# EAGLE design acb (EAGLE 7.5.0)
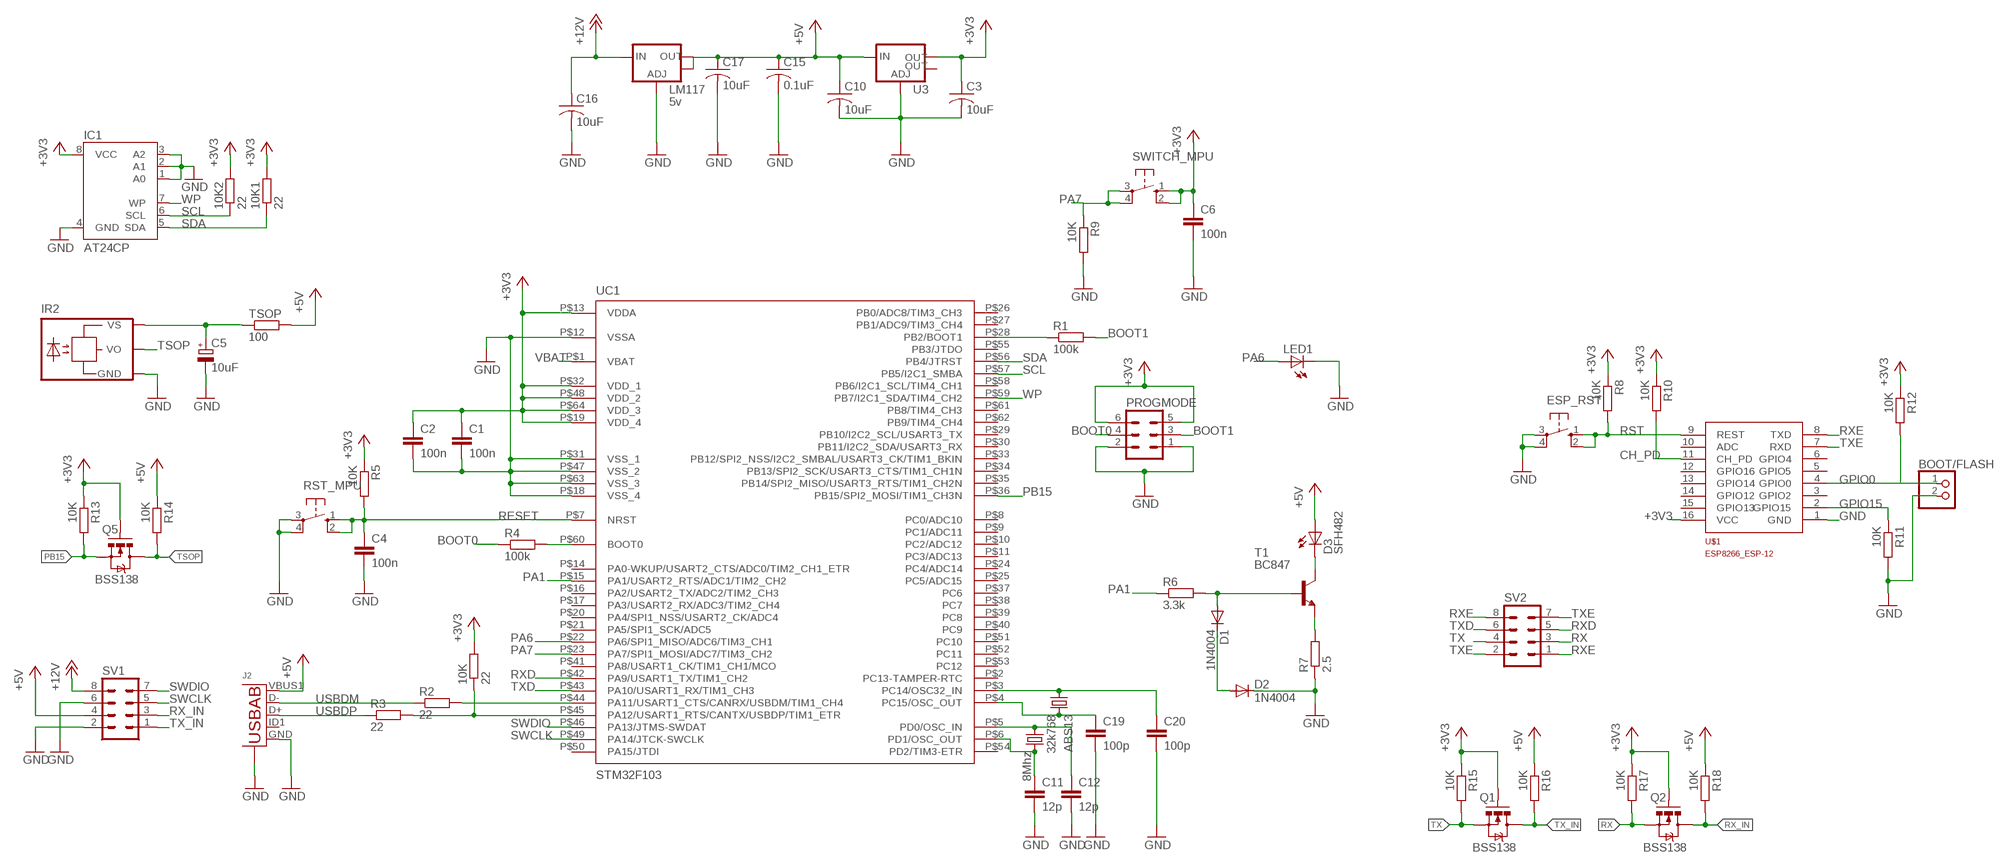
[diagram p0: schematic, sheet 1]

## Parts
10K  22  R-EU_R1206  [R1206]
10K1  22  R-EU_R1206  [R1206]
10K2  22  R-EU_R1206  [R1206]
ABS13  32k768  XTAL_9HT4  [9HT7]
BOOT/FLASH  PINHD-1X2  [1X02]
C1  100n  C-EUC1206  [C1206]
C2  100n  C-EUC1206  [C1206]
C3  10uF  C-USC1206  [C1206]
C4  100n  C-EUC1206  [C1206]
C5  10uF  CPOL-EUE2.5-6  [E2,5-6]
C6  100n  C-EUC1206  [C1206]
C10  10uF  C-USC1206  [C1206]
C11  12p  C-EUC1206  [C1206]
C12  12p  C-EUC1206  [C1206]
C15  0.1uF  C-USC0805  [C0805]
C16  10uF  C-USC0805  [C0805]
C17  10uF  C-USC0805  [C0805]
C19  100p  C-EUC1206  [C1206]
C20  100p  C-EUC1206  [C1206]
D1  1N4004  [DO41-10]
D2  1N4004  [DO41-10]
D3  SFH482  [SFH482]
ESP_RST  10-XX  [B3F-10XX]
IC1  AT24CP  [DIL08]
IR2  TSOP1730TB1  [TSOP17_TB1]
J2  USB-ABBG  [USB-AB-MICRO-SMD_V03_SF]
LED1  LED5MM  [LED5MM]
LM117  5v  V_REG_LM1117SOT223  [SOT223]
PROGMODE  MA03-2  [MA03-2]
Q1  BSS138  MOSFET-NCHANNELSMD  [SOT23-3]
Q2  BSS138  MOSFET-NCHANNELSMD  [SOT23-3]
Q3  8Mhz  CRYSTALHC49U-V  [HC49U-V]
Q5  BSS138  MOSFET-NCHANNELSMD  [SOT23-3]
R1  100k  R-EU_R1206  [R1206]
R2  22  R-EU_R1206  [R1206]
R3  22  R-EU_R1206  [R1206]
R4  100k  R-EU_R1206  [R1206]
R5  10K  R-EU_R1206  [R1206]
R6  3.3k  R-EU_R1206  [R1206]
R7  2.5  R-EU_R1206  [R1206]
R8  10K  R-EU_R1206  [R1206]
R9  10K  R-EU_R1206  [R1206]
R10  10K  R-EU_R1206  [R1206]
R11  10K  R-EU_R1206  [R1206]
R12  10K  R-EU_R1206  [R1206]
R13  10K  R-EU_R1206  [R1206]
R14  10K  R-EU_R1206  [R1206]
R15  10K  R-EU_R1206  [R1206]
R16  10K  R-EU_R1206  [R1206]
R17  10K  R-EU_R1206  [R1206]
R18  10K  R-EU_R1206  [R1206]
RST_MPU  10-XX  [B3F-10XX]
SV1  MA04-2  [MA04-2]
SV2  MA04-2  [MA04-2]
SWITCH_MPU  10-XX  [B3F-10XX]
T1  BC847  [SOT23]
TSOP  100  R-EU_R1206  [R1206]
U3  V_REG_LM1117SOT223  [SOT223]
U$1  ESP8266_ESP-12  [ESP8266-ESP12]
UC1  STM32F103  [TQFP-10X10-64]

## Nets
+3V3: 10K1.2 10K2.2 10K.2 C1.1 C2.1 C3.1 C6.1 IC1.8(VCC) PROGMODE.5 PROGMODE.6 Q1.1(G) Q2.1(G) Q5.1(G) R5.1 R8.1 R10.1 R12.1 R13.1 R15.1 R17.1 SWITCH_MPU.1(S) SWITCH_MPU.2(S1) U3.2(OUT) U$1.16(VCC) UC1.P$13(VDDA) UC1.P$19(VDD_4) UC1.P$32(VDD_1) UC1.P$48(VDD_2) UC1.P$64(VDD_3)
+5V: C10.1 C15.1 C17.1 D3.A J2.VBUS1(VBUS) LM117.2(OUT) LM117.4(OUT) R14.1 R16.1 R18.1 SV1.4 TSOP.2 U3.3(IN)
+12V: C16.1 LM117.3(IN) SV1.8
BOOT0: PROGMODE.4 R4.1
BOOT1: PROGMODE.3 R1.2
CH_PD: R10.2 U$1.11(CH_PD)
GND: BOOT/FLASH.2 C1.2 C2.2 C3.2 C4.2 C5.- C6.2 C10.2 C11.2 C12.2 C15.2 C16.2 C17.2 C19.2 C20.2 D2.C ESP_RST.3(P) ESP_RST.4(P1) IC1.1(A0) IC1.2(A1) IC1.3(A2) IC1.4(GND) IR2.GND J2.GND J2.S1(S) J2.S2(S) J2.S3(S) J2.S4(S) LED1.K(C) LM117.1(ADJ) PROGMODE.1 PROGMODE.2 R7.1 R9.2 R11.2 RST_MPU.3(P) RST_MPU.4(P1) SV1.2 SV1.6 U3.1(ADJ) U$1.1(GND) UC1.P$12(VSSA) UC1.P$18(VSS_4) UC1.P$31(VSS_1) UC1.P$47(VSS_2) UC1.P$63(VSS_3)
GPIO0: BOOT/FLASH.1 R12.2 U$1.4(GPIO0)
GPIO15: R11.1 U$1.2(GPIO15)
N$1: R1.1 UC1.P$28(PB2/BOOT1)
N$2: R2.2 UC1.P$44(PA11/USART1_CTS/CANRX/USBDM/TIM1_CH4)
N$3: 10K.1 R3.2 UC1.P$45(PA12/USART1_RTS/CANTX/USBDP/TIM1_ETR)
N$4: R4.2 UC1.P$60(BOOT0)
N$5: C12.1 Q3.1 UC1.P$5(PD0/OSC_IN)
N$6: C11.1 Q3.2 UC1.P$6(PD1/OSC_OUT)
N$7: ABS13.4 C19.1 UC1.P$4(PC15/OSC_OUT)
N$8: ABS13.1 C20.1 UC1.P$3(PC14/OSC32_IN)
N$9: C5.+ IR2.VS TSOP.1
N$10: D1.A R6.2 T1.1(B)
N$11: D1.C D2.A
N$12: R7.2 T1.2(E)
N$13: D3.K(C) T1.3(C)
PA1: R6.1 UC1.P$15(PA1/USART2_RTS/ADC1/TIM2_CH2)
PA6: LED1.A UC1.P$22(PA6/SPI1_MISO/ADC6/TIM3_CH1)
PA7: R9.1 SWITCH_MPU.3(P) SWITCH_MPU.4(P1) UC1.P$23(PA7/SPI1_MOSI/ADC7/TIM3_CH2)
PB15: Q5.2(S) R13.2 UC1.P$36(PB15/SPI2_MOSI/TIM1_CH3N)
RESET: C4.1 R5.2 RST_MPU.1(S) RST_MPU.2(S1) UC1.P$7(NRST)
RST: ESP_RST.1(S) ESP_RST.2(S1) R8.2 U$1.9(REST)
RX: Q2.2(S) R17.2 SV2.3
RX_IN: Q2.3(D) R18.2 SV1.3
RXD: SV2.5 UC1.P$42(PA9/USART1_TX/TIM1_CH2)
RXE: SV2.1 SV2.8 U$1.8(TXD)
SCL: 10K2.1 IC1.6(SCL) UC1.P$57(PB5/I2C1_SMBA)
SDA: 10K1.1 IC1.5(SDA) UC1.P$56(PB4/JTRST)
SWCLK: SV1.5 UC1.P$49(PA14/JTCK-SWCLK)
SWDIO: SV1.7 UC1.P$46(PA13/JTMS-SWDAT)
TSOP: IR2.VO Q5.3(D) R14.2
TX: Q1.2(S) R15.2 SV2.4
TX_IN: Q1.3(D) R16.2 SV1.1
TXD: SV2.6 UC1.P$43(PA10/USART1_RX/TIM1_CH3)
TXE: SV2.2 SV2.7 U$1.7(RXD)
USBDM: J2.D- R2.1
USBDP: J2.D+ R3.1
VBAT: UC1.P$1(VBAT)
WP: IC1.7(WP) UC1.P$59(PB7/I2C1_SDA/TIM4_CH2)
Unconnected: J2.ID1(USBID) U3.4(OUT) U$1.3(GPIO2) U$1.5(GPIO5) U$1.6(GPIO4) U$1.10(ADC) U$1.12(GPIO16) U$1.13(GPIO14) U$1.14(GPIO12) U$1.15(GPIO13) UC1.P$2(PC13-TAMPER-RTC) UC1.P$8(PC0/ADC10) UC1.P$9(PC1/ADC11) UC1.P$10(PC2/ADC12) UC1.P$11(PC3/ADC13) UC1.P$14(PA0-WKUP/USART2_CTS/ADC0/TIM2_CH1_ETR) UC1.P$16(PA2/USART2_TX/ADC2/TIM2_CH3) UC1.P$17(PA3/USART2_RX/ADC3/TIM2_CH4) UC1.P$20(PA4/SPI1_NSS/USART2_CK/ADC4) UC1.P$21(PA5/SPI1_SCK/ADC5) UC1.P$24(PC4/ADC14) UC1.P$25(PC5/ADC15) UC1.P$26(PB0/ADC8/TIM3_CH3) UC1.P$27(PB1/ADC9/TIM3_CH4) UC1.P$29(PB10/I2C2_SCL/USART3_TX) UC1.P$30(PB11/I2C2_SDA/USART3_RX) UC1.P$33(PB12/SPI2_NSS/I2C2_SMBAL/USART3_CK/TIM1_BKIN) UC1.P$34(PB13/SPI2_SCK/USART3_CTS/TIM1_CH1N) UC1.P$35(PB14/SPI2_MISO/USART3_RTS/TIM1_CH2N) UC1.P$37(PC6) UC1.P$38(PC7) UC1.P$39(PC8) UC1.P$40(PC9) UC1.P$41(PA8/USART1_CK/TIM1_CH1/MCO) UC1.P$50(PA15/JTDI) UC1.P$51(PC10) UC1.P$52(PC11) UC1.P$53(PC12) UC1.P$54(PD2/TIM3-ETR) UC1.P$55(PB3/JTDO) UC1.P$58(PB6/I2C1_SCL/TIM4_CH1) UC1.P$61(PB8/TIM4_CH3) UC1.P$62(PB9/TIM4_CH4)

## Library data of the parts
10K 10K1 10K2 R1-R18 TSOP = rcl:R-EU_: RESISTOR, European symbol
ABS13 = Misc Clock:XTAL_: kHz RANGE CRYSTAL UNIT LOW PROFILE SMD Source: Epson Toyocom FC-12M.pdf
BOOT/FLASH = pinhead:PINHD-1X2: PIN HEADER
C1 C2 C4 C6 C11 C12 C19 C20 = rcl:C-EU: CAPACITOR, European symbol
C3 C10 = rcl:C-US: CAPACITOR, American symbol
C5 = resistor:CPOL-EU: POLARIZED CAPACITOR, European symbol
C15-C17 = resistor:C-US: CAPACITOR, American symbol
D1 D2 = diode:1N4004: DIODE general purpose rectifier, 1 A
D3 = led:SFH482: IR LED infrared emitting diode, Infineon
ESP_RST RST_MPU SWITCH_MPU = switch-omron:10-XX: OMRON SWITCH; MPN: B3F-1000; OC_FARNELL: 176432; OC_NEWARK: 36M3542
IC1 = atmel:AT24C*: 2-wire serial EEPROM; MPN: AT24C1024BW-SH-B; OC_FARNELL: 1362646; OC_NEWARK: 03P2044
IR2 = telefunken:TSOP17*TB1: TSOP17..TB1 IR Receiver Modules for Remote Control Systems Source: http://www.vishay.com/docs/82042/82042.pdf; OC_FARNELL: unknown; OC_NEWARK: unknown
J2 = Misc Conn:USB-AB: This is a USB AB connector that is compatible with USB OTG. i.e. this connector can serve as a host or device
LED1 = led:LED: LED OSRAM: - CHIPLED LG R971, LG N971, LY N971, LG Q971, LY Q971, LO R971, LY R971 LH N974, LH R974 LS Q976, LO Q976, LY Q976 LO Q996 - Hyper CHIPLED LW Q18S LB Q993, LB Q99A, LB R99A - SideLED LS A670, LO A670, LY A670, LG A670, LP A670 LB A673, LV A673, LT A673, LW A673 LH A674 LY A675 LS A676, LA A676, LO A676, LY A676, LW A676 LS A679, LY A679, LG A679 - Hyper Micro SIDELED® LS Y876, LA Y876, LO Y876, LY Y876 LT Y87S - SmartLED LW L88C, LW L88S LB L89C, LB L89S, LG L890 LS L89K, LO L89K, LY L89K LS L896, LA L896, LO L896, LY L896 - TOPLED LS T670, LO T670, LY T670, LG T670, LP T670 LSG T670, LSP T670, LSY T670, LOP T670, LYG T670 LG T671, LOG T671, LSG T671 LB T673, LV T673, LT T673, LW T673 LH T674 LS T676, LA T676, LO T676, LY T676, LB T676, LH T676, LSB T676, LW T676 LB T67C, LV T67C, LT T67C, LS T67K, LO T67K, LY T67K, LW E67C LS E67B, LA E67B, LO E67B, LY E67B, LB E67C, LV E67C, LT E67C LW T67C LS T679, LY T679, LG T679 LS T770, LO T770, LY T770, LG T770, LP T770 LB T773, LV T773, LT T773, LW T773 LH T774 LS E675, LA E675, LY E675, LS T675 LS T776, LA T776, LO T776, LY T776, LB T776 LHGB T686 LT T68C, LB T68C - Hyper Mini TOPLED® LB M676 - Mini TOPLED Santana® LG M470 LS M47K, LO M47K, LY M47K Source: http://www.osram.convergy.de LUXEON: - LUMILED® LXK2-PW12-R00, LXK2-PW12-S00, LXK2-PW14-U00, LXK2-PW14-V00 LXK2-PM12-R00, LXK2-PM12-S00, LXK2-PM14-U00 LXK2-PE12-Q00, LXK2-PE12-R00, LXK2-PE12-S00, LXK2-PE14-T00, LXK2-PE14-U00 LXK2-PB12-K00, LXK2-PB12-L00, LXK2-PB12-M00, LXK2-PB14-N00, LXK2-PB14-P00, LXK2-PB14-Q00 LXK2-PR12-L00, LXK2-PR12-M00, LXK2-PR14-Q00, LXK2-PR14-R00 LXK2-PD12-Q00, LXK2-PD12-R00, LXK2-PD12-S00 LXK2-PH12-R00, LXK2-PH12-S00 LXK2-PL12-P00, LXK2-PL12-Q00, LXK2-PL12-R00 Source: www.luxeon.com KINGBRIGHT: KA-3528ASYC Source: www.kingbright.com
LM117 = SparkFun:V_REG_LM1117: Voltage Regulator LM1117 Standard adjustable voltage regulator but in SMD form. Spark Fun Electronics SKU : COM-00595
PROGMODE = con-lstb:MA03-2: PIN HEADER; OC_FARNELL: unknown; OC_NEWARK: unknown
Q1 Q2 Q5 = SparkFun:MOSFET-NCHANNEL
Q3 = crystal:CRYSTAL: CRYSTAL; OC_FARNELL: 1666969; OC_NEWARK: unknown
SV1 SV2 = con-lstb:MA04-2: PIN HEADER; OC_FARNELL: unknown; OC_NEWARK: unknown
T1 = transistor:BC847: NPN TRANSISTOR
U3 = SparkFun-PowerIC:V_REG_LM1117: Voltage Regulator LM1117 Standard adjustable voltage regulator but in SMD form. Spark Fun Electronics SKU : COM-00595; PROD_ID: VREG-08170
U$1 = ESP8266-ESP12:ESP8266_ESP-12
UC1 = st-microelectronics:STM32F103

## Net classes
1 vcc: width 0.254 mm

## Board
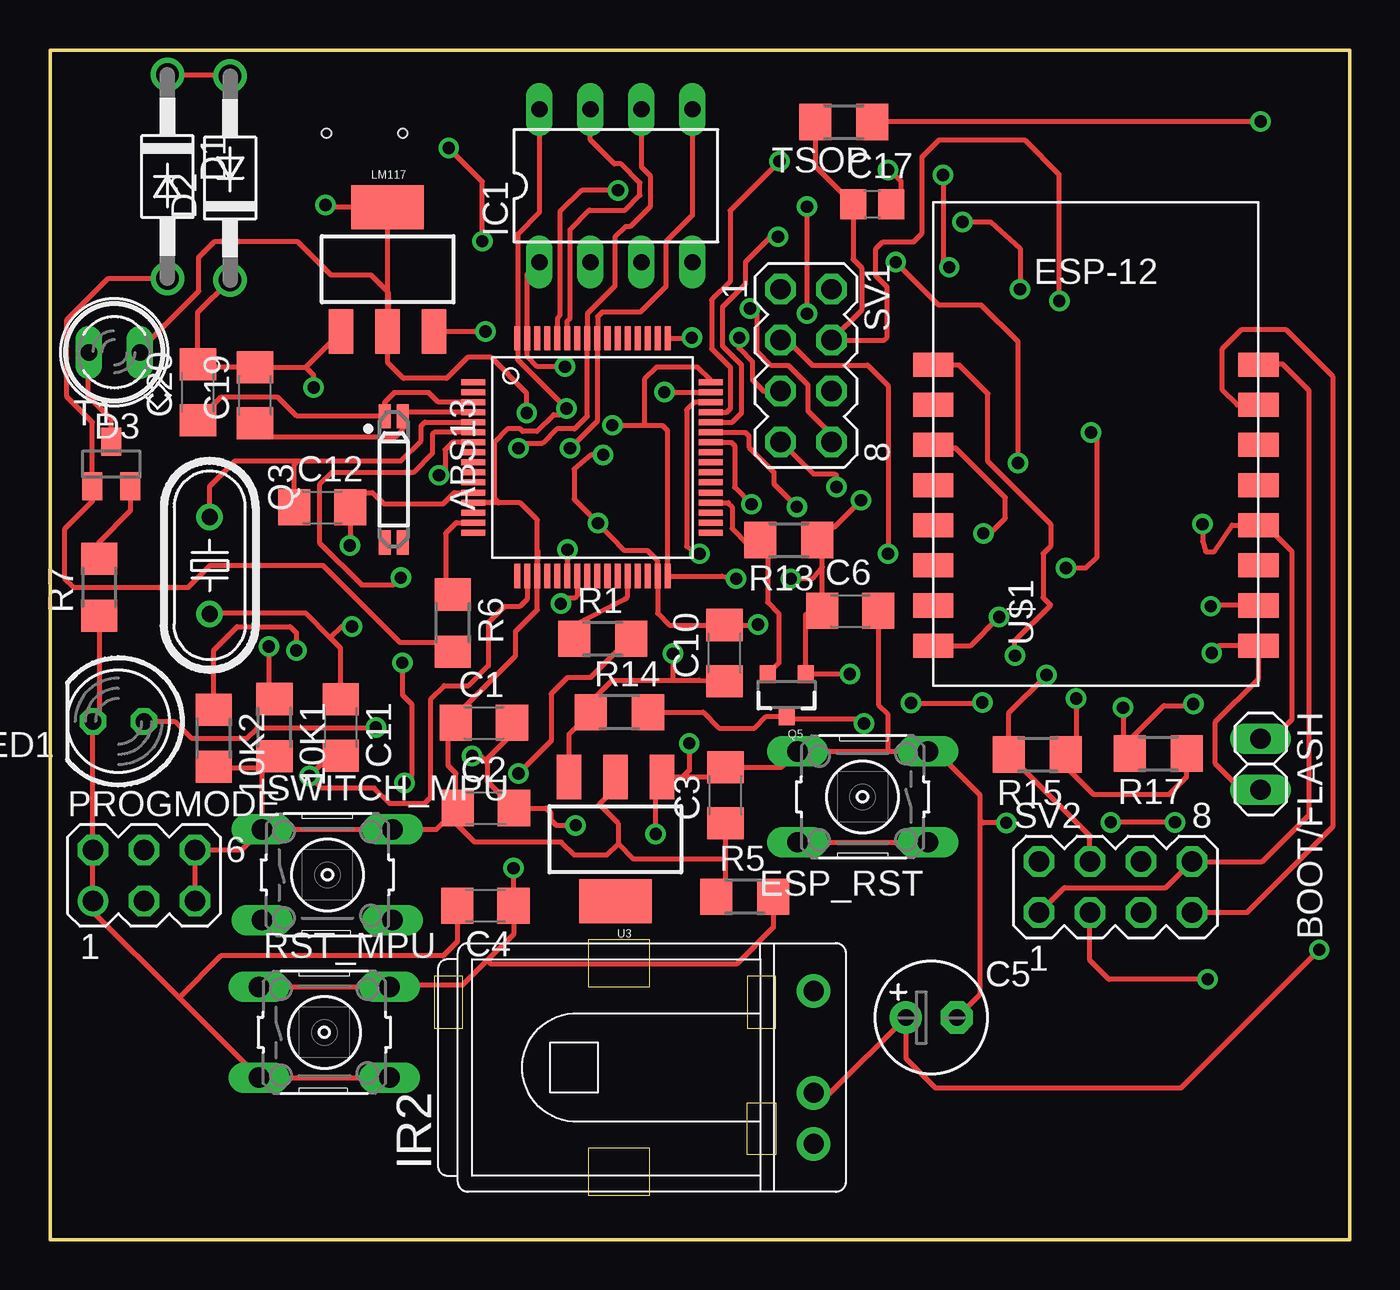
[diagram p1: board, top side]
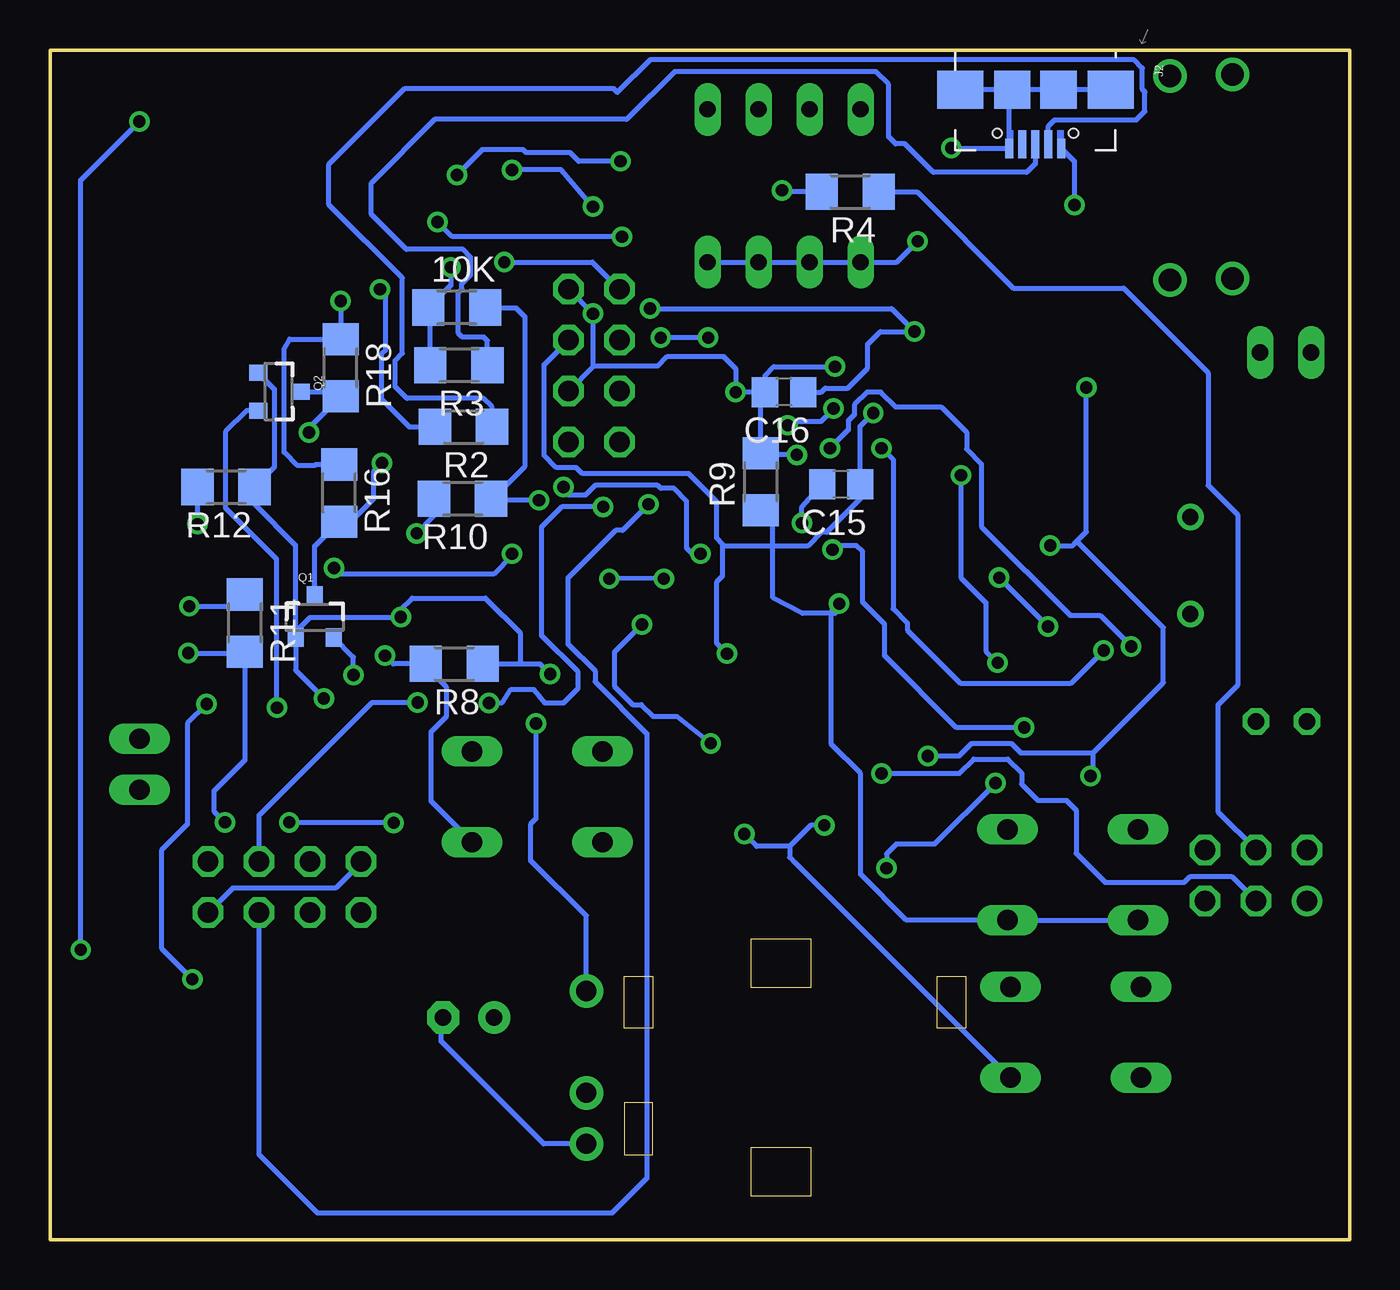
[diagram p2: board, bottom side, seen from below]

Size 64.77 x 59.28 mm. Coordinates in mm from the lower left corner, seen from the top.
Outline: 0,59.28 0,0 64.77,0 64.77,59.28 0,59.28
Copper layers ((1*2)+(15*16)): Top 0.09mm / dielectric 0.2mm / Route2 0.07mm / dielectric 1.5mm / Route15 0.07mm / dielectric 0.2mm / Bottom 0.09mm
Design rules "default *": minimum track width 10mil, minimum drill 24mil, track to track 8mil, track to pad 8mil, pad to pad 8mil, via to via 8mil, smd to smd 8mil, copper to edge 40mil, drill to drill 8mil, minimum pad ring 10mil, minimum via ring 8mil, stop-mask expansion 4mil, vias tented up to drill 0mil, thermal gap 10mil

### Footprints (pad centres in the part's own frame; a part is rotated, then mirrored left to right if it is on the bottom)
R1206 = smd 1.6 x 1.803: 1 -1.422,0; 2 1.422,0
9HT7 = smd 1.2 x 0.6: 1 -3.15,-0.45; 2 3.15,-0.45; 3 3.15,0.45; 4 -3.15,0.45
1X02 = drill 1.016 long: 1 -1.27,0; 2 1.27,0
C1206 = smd 1.6 x 1.8: 1 -1.4,0; 2 1.4,0
E2,5-6 = drill 0.813 pad 1.6: + -1.27,0 | drill 0.813 pad 1.6 octagon: - 1.27,0
C0805 = smd 1.3 x 1.5: 1 -0.95,0; 2 0.95,0
DO41-10 = drill 1.118: A 5.08,0; C -5.08,0
SFH482 = drill 0.813 long: A -1.27,0; K 1.27,0
B3F-10XX = drill 1.016 long: 1 -3.251,2.261; 2 3.251,2.261; 3 -3.251,-2.261; 4 3.251,-2.261
DIL08 = drill 0.813 long: 1 -3.81,-3.81; 2 -1.27,-3.81; 3 1.27,-3.81; 4 3.81,-3.81; 5 3.81,3.81; 6 1.27,3.81; 7 -1.27,3.81; 8 -3.81,3.81
TSOP17_TB1 = drill 1 pad 1.676: GND 0,-3.81; VO 0,3.81; VS 0,-1.27
USB-AB-MICRO-SMD_V03_SF = smd 1.4 x 0.4: D+ 2.7,0; D- 2.7,0.65; ID1 2.7,-0.65 | smd 0.975 x 0.4: GND 2.913,-1.3; VBUS1 2.913,1.3 | smd 1.9 x 2.3: S1 0,3.75; S4 0,-3.75 | smd 1.9 x 1.8: S2 0,1.15; S3 0,-1.15 | hole 0.45: 2.15,1.9; 2.15,-1.9
LED5MM = drill 0.813 octagon: A -1.27,0; K 1.27,0
SOT223 = smd 1.219 x 2.235: 1 -2.311,-3.099; 2 0,-3.099; 3 2.311,-3.099 | smd 3.6 x 2.2: 4 0,3.099
MA03-2 = drill 1.016: 1 -2.54,-1.27 | drill 1.016 octagon: 2 -2.54,1.27; 3 0,-1.27; 4 0,1.27; 5 2.54,-1.27; 6 2.54,1.27
SOT23-3 = smd 0.8 x 0.9: 1 -0.95,-1; 2 0.95,-1; 3 0,1.1
HC49U-V = drill 0.813: 1 -2.413,0; 2 2.413,0
MA04-2 = drill 1.016 octagon: 1 -3.81,-1.27; 2 -3.81,1.27; 3 -1.27,-1.27; 4 -1.27,1.27; 5 1.27,-1.27; 6 1.27,1.27; 7 3.81,-1.27; 8 3.81,1.27
SOT23 = smd 1 x 1.4: 1 -0.95,-1.1; 2 0.95,-1.1; 3 0,1.1
ESP8266-ESP12 = smd 2 x 1.2: 1 16.2,2; 2 16.2,4; 3 16.2,6; 4 16.2,8; 5 16.2,10; 6 16.2,12; 7 16.2,14; 8 16.2,16; 9 0,16; 10 0,14; 11 0,12; 12 0,10; 13 0,8; 14 0,6; 15 0,4; 16 0,2
TQFP-10X10-64 = smd 1.2 x 0.3: P$1 -5.936,3.75; P$2 -5.936,3.25; P$3 -5.936,2.75; P$4 -5.936,2.25; P$5 -5.936,1.75; P$6 -5.936,1.25; P$7 -5.936,0.75; P$8 -5.936,0.25; P$9 -5.936,-0.25; P$10 -5.936,-0.75; P$11 -5.936,-1.25; P$12 -5.936,-1.75; P$13 -5.936,-2.25; P$14 -5.936,-2.75; P$15 -5.936,-3.25; P$16 -5.936,-3.75; P$33 5.886,-3.75; P$34 5.886,-3.25; P$35 5.886,-2.75; P$36 5.886,-2.25; P$37 5.886,-1.75; P$38 5.886,-1.25; P$39 5.886,-0.75; P$40 5.886,-0.25; P$41 5.886,0.25; P$42 5.886,0.75; P$43 5.886,1.25; P$44 5.886,1.75; P$45 5.886,2.25; P$46 5.886,2.75; P$47 5.886,3.25; P$48 5.886,3.75 | smd 0.3 x 1.2: P$17 -3.75,-5.911; P$18 -3.25,-5.911; P$19 -2.75,-5.911; P$20 -2.25,-5.911; P$21 -1.75,-5.911; P$22 -1.25,-5.911; P$23 -0.75,-5.911; P$24 -0.25,-5.911; P$25 0.25,-5.911; P$26 0.75,-5.911; P$27 1.25,-5.911; P$28 1.75,-5.911; P$29 2.25,-5.911; P$30 2.75,-5.911; P$31 3.25,-5.911; P$32 3.75,-5.911; P$49 3.75,5.936; P$50 3.25,5.936; P$51 2.75,5.936; P$52 2.25,5.936; P$53 1.75,5.936; P$54 1.25,5.936; P$55 0.75,5.936; P$56 0.25,5.936; P$57 -0.25,5.936; P$58 -0.75,5.936; P$59 -1.25,5.936; P$60 -1.75,5.936; P$61 -2.25,5.936; P$62 -2.75,5.936; P$63 -3.25,5.936; P$64 -3.75,5.936

### Placement (x,y rotation side)
10K  44.5,46.46 0 bottom
10K1  11.18,25.53 270 top
10K2  8.15,24.99 270 top
ABS13  17.12,37.9 270 top
BOOT/FLASH  60.32,23.7 270 top
C1  21.62,25.76 0 top
C2  21.72,21.51 0 top
C3  33.65,22.15 90 top
C4  21.69,16.64 180 top
C5  43.92,11.07 0 top
C6  39.88,31.34 0 top
C10  33.6,29.24 90 top
C11  14.48,25.53 270 top
C12  13.56,36.5 0 top
C15  25.35,37.64 180 bottom
C16  28.19,42.24 180 bottom
C17  40.97,51.61 0 top
C19  10.21,42.09 90 top
C20  7.37,42.24 90 top
D1  5.84,52.98 270 top
D2  8.97,52.91 90 top
D3  3.2,44.22 180 top
ESP_RST  40.49,22.07 180 top
IC1  28.19,52.53 0 top
IR2  38.05,8.59 0 top
J2  15.67,57.3 270 bottom
LED1  3.4,25.83 180 top
LM117  16.81,48.36 0 top
PROGMODE  4.67,18.16 0 top
Q1  51.59,31.01 0 bottom
Q2  53.39,42.27 270 bottom
Q3  7.95,33.6 270 top
Q5  36.7,27.18 180 top
R1  27.53,29.95 0 top
R2  44.17,40.51 180 bottom
R3  44.4,43.59 180 bottom
R4  24.89,52.22 180 bottom
R5  34.62,17.09 0 top
R6  20.07,30.73 270 top
R7  2.44,32.51 90 top
R8  44.63,28.7 180 bottom
R9  29.36,37.77 90 bottom
R10  44.22,36.93 180 bottom
R11  55.07,30.73 270 bottom
R12  56.01,37.52 180 bottom
R13  36.8,34.87 180 top
R14  28.37,26.29 0 top
R15  49.2,24.18 180 top
R16  50.37,37.21 270 bottom
R17  55.22,24.23 180 top
R18  50.29,43.46 270 bottom
RST_MPU  13.67,10.34 0 top
SV1  37.67,43.56 270 top
SV2  53.09,17.58 0 top
SWITCH_MPU  13.82,18.19 0 top
T1  3.05,38.66 0 top
TSOP  39.55,55.7 180 top
U3  28.17,19.96 180 top
U$1  44.02,27.61 0 top
UC1  27.03,38.99 0 top

### Tracks (layer width: path | path; a pad name or v marks a point on that pad's centre or on a via)
+3V3  (via drill 0.61)
  Top 0.254: 38.48,33.53 C6.1 37.65,31.15 Q5.1 37.67,28.19 v39.85,28.19 | 38.48,33.53 38.48,35.51 | 38.48,35.51 R13.1 | UC1.P$19 24.28,31.39 23.19,30.3 23.19,29.08 20.21,26.11 C1.1 19.84,25.38 19.84,23.62 20.21,23.24 20.21,21.62 C2.1 19.89,21.08 | SWITCH_MPU.1 10.57,23.5 | 10.57,23.5 10K1.2 | 10.57,23.5 8.23,23.5 10K2.2 | PROGMODE.5 PROGMODE.6 9.55,19.43 SWITCH_MPU.1 | SWITCH_MPU.1 SWITCH_MPU.2 19.25,20.45 19.89,21.08 | v34.19,32.94 33.48,33.08 UC1.P$32 30.78,39.66 30.76,39.67 30.76,40.34 30.51,40.59 29.69,40.59 | v36.91,32.94 38.02,32.97 38.48,33.53 | 24.31,34.32 24.28,33.31 UC1.P$19 | UC1.P$19 24.28,35.87 23.42,36.73 22.35,36.73 | 22.35,36.73 21.1,36.73 UC1.P$13 | IC1.8 24.38,51.21 23.29,50.11 23.29,44.94 | 23.29,44.94 UC1.P$64 | U3.2 28.17,22.5 27.36,21.69 28.3,20.75 28.3,19.73 | 19.89,21.08 21.16,19.81 25.48,19.81 26.11,19.18 27.74,19.18 28.3,19.73 | C3.1 33.65,19.05 | 33.65,19.05 33.65,17.55 R5.1 | 23.29,44.94 23.29,43.87 v25.73,41.43 25.42,41.12 25.09,41.12 24.26,40.28 23.55,40.28 23.42,40.41 22.78,40.41 22.12,39.75 22.12,36.96 22.35,36.73 | R17.1 56.64,23.06 55.78,22.2 51.99,22.2 50.62,23.57 R15.1 51.13,24.69 v51.13,26.97 | R17.1 | 38.48,35.51 39.07,35.51 v40.41,36.86 | U$1.16 45.87,29.61 v47.29,31.04 | 28.3,19.73 29.03,19 33.6,19 33.65,19.05 | UC1.P$48 32.91,42.83 32.26,43.48 30.23,43.48 29.62,42.88 29.62,40.67 29.69,40.59 | v28.02,40.59 29.69,40.59
  Bottom 0.254: R8.1 41.25,28.7 | 41.25,28.7 40.36,28.7 v39.85,28.19 | v34.19,32.94 36.91,32.97 v36.91,32.94 | v40.41,36.86 42.72,36.86 R10.1 42.72,36.93 41.1,38.56 41.1,45.97 41.55,46.43 43.05,46.43 10K.2 | Q1.1 52.54,28.38 v51.13,26.97 | 41.25,28.7 41.35,28.8 41.35,30.25 43.08,31.98 46.74,31.98 47.29,31.42 v47.29,31.04 47.32,31.01 51.82,31.01 52.54,30.29 Q1.1 | Q1.1 52.55,30.03 52.55,34.62 54.59,36.65 R12.1 53.59,38.51 53.59,42.39 54.39,43.19 Q2.1 | v25.73,41.43 25.73,41.4 26.37,40.77 27.84,40.77 v28.02,40.59
+5V  (via drill 0.61)
  Top 0.254: D3.A 4.52,44.22 4.52,44.37 7.42,47.27 7.42,48.97 8.2,49.76 12.32,49.76 13.99,48.08 15.98,48.08 16.84,47.22 16.84,45.29 LM117.2 | LM117.2 LM117.4 13.82,51.46 v13.72,51.56 | v23.75,41.2 23.75,42.19 21.97,43.97 20.8,43.97 19.76,42.93 17.6,42.93 16.81,43.71 LM117.2 | 31.06,27.89 28.02,27.89 26.95,26.82 R14.1 25.86,25.2 U3.3 | 31.06,27.89 32.33,27.89 C10.1 | v31.04,29.21 31.04,27.91 31.06,27.89 | TSOP.2 38.13,53.51 C17.1 40.02,48.85 40.44,48.44 40.44,46.33 SV1.4 41.55,44.83 41.71,44.98 41.71,47.47 41.15,48.03 41.15,49.38 41.5,49.73 43.03,49.73 43.46,50.16 43.46,53.97 44.3,54.81 48.57,54.81 50.27,53.11 50.27,46.81 v50.29,46.79
  Bottom 0.254: v13.72,51.56 13.72,53.73 J2.VBUS1 | v23.75,41.2 24.4,40.55 C15.1 24.4,36.92 26.06,35.26 26.34,35.26 27.03,34.57 31.24,34.57 31.27,34.59 | v31.04,29.21 31.57,29.74 31.57,32.77 31.27,33.07 31.27,34.59 | 38.94,44.78 SV1.4 40.16,43.61 40.16,39.09 39.55,38.48 38.56,38.48 38.25,38.18 32.94,38.18 31.57,36.8 31.57,34.98 31.27,34.67 31.27,34.59 | R16.1 51.54,38.63 51.56,38.61 52.48,38.61 53.11,39.24 53.11,44.4 52.83,44.88 R18.1 | R18.1 | v50.29,46.79 R18.1
+12V  (via drill 0.61)
  Top 0.254: v21.69,45.26 LM117.3 | v38.94,39.83 38.94,40.13 37.77,41.3 37.77,42.6 36.8,43.56 35.94,43.56 35.23,44.27 35.23,46.05 v34.87,46.41
  Bottom 0.254: SV1.8 v38.94,39.83 | v34.87,46.41 22.84,46.41 v21.69,45.26 23.39,45.26 24.03,44.63 24.03,43.43 25.02,42.44 26.14,42.44 26.34,42.24 C16.1
BOOT0
  Bottom 0.254: R4.1 21.56,52.22 16.76,47.42 11.28,47.42 7.06,43.21 7.06,37.59 5.59,36.12 5.59,27.64 6.58,26.64 6.58,21.34 PROGMODE.4
BOOT1  (via drill 0.61)
  Top 0.254: R1.2 28.85,29.95 26.92,28.02 25.78,28.02 24.97,27.2 24.97,24.87 v23.34,23.24
  Bottom 0.254: v23.34,23.24 19.46,23.24 18.74,23.95 17.04,23.95 16.36,23.27 16.36,22.71 15.55,21.89 14.12,21.89 13.64,21.41 13.64,19.25 12.19,17.81 8.25,17.81 7.95,18.11 5.89,18.11 PROGMODE.3
CH_PD  (via drill 0.61)
  Top 0.254: v46.51,35.2 46.84,35.2 47.6,35.97 47.6,36.98 45.14,39.45 44.18,39.45 U$1.11
  Bottom 0.254: R10.2 45.64,36.07 v46.51,35.2
GND  (via drill 0.61)
  Top 0.254: C1.2 23.02,25.2 21.79,23.98 21.79,23.77 | 21.79,23.77 21.79,22.84 C2.2 24.71,21.51 24.94,21.29 24.94,20.93 25.22,20.65 v26.19,20.65 | RST_MPU.4 RST_MPU.3 6.43,12.06 | 6.43,12.06 2.13,16.36 PROGMODE.1 PROGMODE.2 LED1.K 2.44,26.14 R7.1 | C4.2 20.29,14.86 19.58,14.15 8.51,14.15 6.43,12.06 | BOOT/FLASH.2 59.36,22.43 58.06,23.72 58.06,25.81 60.22,27.97 U$1.1 58.26,29.61 v57.89,29.24 | 31.52,23.06 U3.1 30.18,22.76 v30.18,20.22 | 31.52,23.06 33.17,23.06 C3.2 36.45,23.55 ESP_RST.4 41.78,24.33 | 41.78,24.33 ESP_RST.3 44.17,24.33 46.33,22.17 46.33,20.93 | IC1.1 23.78,48.11 UC1.P$63 23.77,44.02 24.28,43.51 v25.65,43.51 | v21.54,49.76 21.54,52.73 v19.86,54.41 | 12.73,43.49 C19.2 7.52,43.49 C20.2 7.37,46.23 D2.C | 12.73,43.49 LM117.1 | v37.72,46.15 v37.72,51.49 | v41.76,53.31 41.81,53.34 42.39,52.76 42.39,52.09 C17.2 | 46.33,20.93 46.33,12.22 C5.- | C6.2 41.28,26.67 41.73,26.21 41.73,24.38 41.78,24.33 | v56.06,20.8 v52.86,20.8 | v47.65,20.78 46.48,20.78 46.33,20.93 | v14.93,34.59 14.96,34.62 C12.2 15.7,37.24 16.08,37.24 16.64,36.68 19.58,36.68 20.14,37.24 UC1.P$12 | v13.13,42.47 13.13,43.08 12.73,43.49 | C11.2 13.94,24.13 v12.93,23.11 13.54,22.5 16.15,22.5 16.92,21.74 18.67,21.74 18.97,22.05 18.97,26.95 19.63,27.61 20.85,27.61 21.84,28.6 21.84,30.76 22.63,31.55 23.39,31.55 23.78,31.93 UC1.P$18 | v21.03,24.1 21.46,24.1 21.79,23.77 | v35.28,30.66 35.26,30.64 C10.2 30.86,30.63 30.28,31.22 UC1.P$31 30.28,33.83 29.77,34.34 28.63,34.34 v27.3,35.71 26.11,36.91 26.11,38.4 26.98,39.12 v27.56,39.12 | v31.85,24.74 31.85,23.39 31.52,23.06 | v30.61,42.24 UC1.P$47
  Bottom 0.254: IR2.GND 40.18,4.78 45.29,9.88 45.29,10.97 C5.- | v57.89,29.24 55.14,29.24 R11.2 55.07,23.9 56.62,22.35 56.62,21.36 v56.06,20.8 | v21.54,49.76 22.58,48.72 IC1.1 IC1.2 IC1.3 IC1.4 | v19.86,54.41 16.99,54.41 J2.GND 16.97,57.15 J2.S3 | J2.S1 J2.S2 | J2.S2 14.96,57.3 15.06,57.2 14.62,57.2 J2.S2 | J2.S2 J2.S3 | J2.S3 J2.S4 | SV1.2 v37.72,46.15 37.69,46.13 37.69,43.54 | v37.72,51.49 39.29,53.31 v41.76,53.31 | v52.86,20.8 47.68,20.8 v47.65,20.78 | C16.2 29.14,43.07 28.7,43.51 v25.65,43.51 | v14.93,34.59 13.82,34.59 13.6,34.81 | 13.6,34.81 13.13,35.28 v13.13,42.47 | 12.8,24.26 16.38,24.26 16.84,24.71 18.87,24.71 19.48,24.1 v21.03,24.1 | v26.19,20.65 26.87,20.65 27.91,19.61 | 27.91,19.61 27.91,19.05 27.63,18.77 27.61,18.77 RST_MPU.4 | 27.91,19.61 29.57,19.61 v30.18,20.22 | v35.28,30.66 36.65,29.29 36.65,27.58 35.74,26.67 35.31,26.67 34.72,26.09 33.55,26.09 v31.85,24.74 | 37.69,43.54 34.49,43.54 34.01,44.02 31.22,44.02 30.61,43.41 v30.61,42.24 C16.2 | 37.69,43.54 SV1.6 | C16.2 29.36,42.02 R9.2 29.29,39.12 v27.56,39.12 | v27.3,35.71 27.3,36.51 C15.2 | 12.8,24.26 9.3,27.76 9.3,30.51 13.6,34.81 | 12.8,24.26 12.8,23.24 v12.93,23.11
GPIO0  (via drill 0.61)
  Top 0.254: v57.43,35.66 57.43,34.8 57.58,34.29 58.01,34.29 58.9,35.61 U$1.4 60.58,35.61 61.87,34.32 61.87,25.91 61.16,25.2 60.55,25.2 BOOT/FLASH.1
  Bottom 0.254: R12.2 57.43,36.73 v57.43,35.66
GPIO15  (via drill 0.61)
  Top 0.254: U$1.2 57.87,31.61 v57.84,31.57
  Bottom 0.254: v57.84,31.57 55.65,31.57 R11.1
N$1
  Top 0.254: R1.1 26.16,30.66 28.63,31.93 28.65,31.93 28.78,32.05 UC1.P$28
N$2  (via drill 0.61)
  Top 0.254: UC1.P$44 33.98,40.74 34.44,41.2 34.44,43.61 33.5,44.55 33.5,46.48 34.65,47.62 34.65,48.72 35.92,49.99 v36.27,49.99 | v45.47,50.72 46.86,50.72 48.34,49.4 v48.34,47.37
  Bottom 0.254: R2.2 46.86,40.51 48.26,41.91 48.26,44.12 48.06,44.32 48.06,47.09 v48.34,47.37 | v36.27,49.99 44.73,49.99 v45.47,50.72
N$3  (via drill 0.61)
  Top 0.254: UC1.P$45 33.72,41.24 33.91,41.43 33.91,43.46 32.97,44.4 32.97,46.84 33.88,47.75 33.88,51.28 v36.35,53.75 | v44.5,53.06 44.5,48.77 v44.81,48.46
  Bottom 0.254: v44.5,53.06 43.23,54.33 41.2,54.33 41.05,54.18 38.86,54.18 38.43,53.75 v36.35,53.75 | v44.81,48.46 44.81,47.57 10K.1 45.82,46.35 R3.2
N$4  (via drill 0.61)
  Top 0.254: v28.3,52.3 26.49,52.3 25.4,51.23 25.4,46.08 25.27,45.92 UC1.P$60
  Bottom 0.254: R4.2 28.22,52.22 v28.3,52.3
N$5
  Top 0.254: Q3.1 7.95,37.54 9.22,38.81 12.37,38.81 | 12.37,38.81 17.48,38.81 18.49,39.83 18.49,40.56 18.67,40.74 UC1.P$5 | C12.1 12.16,38.6 12.37,38.81
N$6  (via drill 0.61)
  Top 0.254: C11.1 14.48,29.49 13.97,30 | 13.97,30 12.75,31.22 7.98,31.22 Q3.2 | UC1.P$6 19.13,40.24 19.05,40.16 19.05,39.19 18.09,38.23 14.02,38.23 13.41,37.62 13.41,34.75 15.52,32.64 17.12,32.64 v17.48,32.99 | v15.04,30.56 14.53,30.56 13.97,30
  Bottom 0.254: v17.48,32.99 v15.04,30.56
N$7
  Top 0.254: UC1.P$4 17.76,41.24 ABS13.4 17.57,40.38 17.2,40 10.89,40 C19.1
N$8
  Top 0.254: UC1.P$3 19.35,41.74 18.87,42.21 17.14,42.21 16.66,41.73 ABS13.1 12.29,41.05 11.35,41.99 8.51,41.99 C20.1
N$9  (via drill 0.61)
  Top 0.254: IR2.VS 38.89,7.32 C5.+ 42.65,9.04 44.12,7.57 56.36,7.57 v63.25,14.45 | v60.32,55.73 40.99,55.73 TSOP.1
  Bottom 0.254: v63.25,14.45 63.25,52.81 v60.32,55.73
N$10
  Top 0.254: D1.A 2.9,47.9 0.84,45.85 0.84,42.01 2.1,40.75 T1.1 2.1,36.79 0.71,35.41 0.71,32.97 1.17,32.51 6.88,32.51 7.98,33.6 13.59,33.6 17.42,29.77 19.61,29.77 R6.2
N$11
  Top 0.254: D1.C 8.89,58.06 D2.A
N$12
  Top 0.254: R7.2 2.44,34.77 4.01,36.35 4.01,37.54 T1.2
N$13
  Top 0.254: T1.3 3.05,40.89 1.91,42.04 1.91,44.2 D3.K
PA1
  Top 0.254: R6.1 19.71,32.51 19.71,35.2 20.24,35.74 UC1.P$15
PA6  (via drill 0.61)
  Top 0.254: LED1.A 6.2,25.83 7.04,24.99 9.8,24.99 10.34,25.53 v16.23,25.53 | v25.78,34.39 UC1.P$22
  Bottom 0.254: v16.23,25.53 19.61,25.53 23.19,29.11 23.19,30.68 24.28,31.78 24.28,34.29 24.59,34.59 25.58,34.59 v25.78,34.39
PA7  (via drill 0.61)
  Top 0.254: UC1.P$23 26.28,32.12 26.14,31.98 25.73,31.98 v25.45,31.7
  Bottom 0.254: R9.1 28.75,35.74 28.75,32 27.3,31.24 27.28,31.22 25.65,31.22 25.45,31.42 v25.45,31.7 25.83,31.32 25.83,24.69 24.38,23.24 24.38,18.21 22.1,15.93 SWITCH_MPU.4 SWITCH_MPU.3
PB15
  Top 0.254: UC1.P$36 33.8,36.74 33.8,36.71 33.98,36.53 33.98,35.43 34.75,34.67 35.18,34.67 R13.2 35.75,35.39 35.75,31.76 36.32,31.19 36.32,28.75 Q5.2
RESET  (via drill 0.61)
  Top 0.254: 21.79,13.92 23.09,15.22 C4.1 v23.09,18.52 | 21.79,13.92 20.55,12.67 16.99,12.67 RST_MPU.2 RST_MPU.1 | R5.2 36.04,15.57 34.21,13.74 21.97,13.74 21.79,13.92 | UC1.P$7 20.05,39.74 19.68,39.37 19.68,38.4 v19.38,38.1 | v17.55,28.75 17.55,27.15 18.01,26.7 18.01,23.11 v17.65,22.76
  Bottom 0.254: v17.55,28.75 18.14,29.34 18.14,31.75 19.38,32.99 v19.38,38.1 | v23.09,18.52 23.09,19.23 22.61,19.71 20.7,19.71 v17.65,22.76
RST  (via drill 0.61)
  Top 0.254: ESP_RST.2 ESP_RST.1 | v48.08,29.11 48.08,29.84 49.86,31.62 49.48,32 49.48,34.19 49.86,34.57 49.86,35.66 46.74,38.79 46.74,42.16 45.31,43.59 44.04,43.59 U$1.9
  Bottom 0.254: ESP_RST.1 45.8,21.87 45.8,25.3 45.03,26.06 45.03,27.56 46.05,28.57 R8.2 47.68,28.7 v48.08,29.11
RX  (via drill 0.61)
  Top 0.254: v53.47,26.52 53.47,24.56 R17.2 53.8,24.92 55.5,26.62 56.9,26.62 v56.97,26.7 | v57.68,12.98 52.76,12.98 51.82,13.92 SV2.3
  Bottom 0.254: v53.47,26.52 53.49,26.54 53.49,33.93 56.03,36.47 56.03,40.26 54.98,41.32 Q2.2 | v56.97,26.7 57.94,25.73 57.94,20.7 59.23,19.41 59.23,14.53 v57.68,12.98
RX_IN  (via drill 0.61)
  Top 0.254: SV1.3 36.73,44.83 37.97,43.59 40.74,43.59 41.76,42.57 v41.76,34.19 | v50.62,33.48 51.61,33.48 52.17,34.04 52.17,39.93 v51.87,40.23
  Bottom 0.254: Q2.3 50.52,42.27 R18.2 51.87,40.46 v51.87,40.23 | v41.76,34.19 41.76,34.09 42.67,33.17 50.32,33.17 v50.62,33.48
RXD  (via drill 0.61)
  Top 0.254: UC1.P$42 33.95,39.74 34.11,39.57 34.11,37.49 v34.95,36.65
  Bottom 0.254: v34.95,36.65 36.25,35.36 36.58,35.36 38.96,32.97 38.96,29.69 37.62,28.35 37.62,27.81 35.03,25.22 35.03,3.07 36.78,1.32 51.43,1.32 54.36,4.24 SV2.5
RXE
  Top 0.254: SV2.1 49.3,16.31 50.55,17.55 55.6,17.55 SV2.8 60.4,18.85 62.74,21.18 62.74,42.32 61.42,43.64 60.25,43.64 U$1.8
SCL  (via drill 0.61)
  Top 0.254: IC1.6 29.46,53.47 29.9,53.04 29.9,51.49 28.9,50.5 28.68,50.5 28.14,49.96 28.14,47.52 26.77,46.15 UC1.P$57 26.77,41.05 26.14,40.41 25.25,40.41 24.54,39.7 23.6,39.7 v23.34,39.45 | 10K2.1 8.15,29.39 9.32,30.56 11.96,30.56 12.27,30.25 v12.27,29.36
  Bottom 0.254: v23.34,39.45 23.32,39.45 22.76,38.89 22.76,31.45 22.05,30.73 22.05,30.38 19.41,27.74 13.89,27.74 v12.27,29.36
SDA  (via drill 0.61)
  Top 0.254: IC1.5 32,51.05 30.68,49.73 30.68,47.5 29.41,46.23 27.51,46.23 27.28,46 UC1.P$56 27.28,40.82 v25.91,39.45 | v10.9,29.57 10.9,27.23 10K1.1
  Bottom 0.254: v10.9,29.57 12.45,31.11 13.95,31.11 18.36,35.53 18.36,38.66 19.1,39.4 19.1,40.23 20.37,41.5 22.63,41.5 23.37,42.24 24.05,42.24 24.69,41.61 24.69,41.12 24.99,40.82 24.99,40.36 v25.91,39.45
SWCLK  (via drill 0.61)
  Top 0.254: UC1.P$49 31.95,44.93 v31.98,44.96 | v34.34,44.96 34.34,44.42 35,43.76 35,42.85 35.56,42.29 SV1.5
  Bottom 0.254: v31.98,44.96 v34.34,44.96
SWDIO  (via drill 0.61)
  Top 0.254: UC1.P$46 32.11,41.74 31.73,41.35 31.73,34.54 v32.36,34.19 | v39.19,37.52 39.19,38.1 39.09,38.15 38.05,38.15 SV1.7
  Bottom 0.254: v32.36,34.19 32.77,34.19 33.04,34.47 33.04,36.8 33.68,37.44 34.34,37.44 34.49,37.59 37.62,37.59 38.1,37.11 38.96,37.11 v39.19,37.52
TSOP  (via drill 0.61)
  Top 0.254: v40.56,25.73 40.34,25.96 36.82,25.96 Q5.3 36.7,26.09 35.69,26.09 35.1,25.5 33.32,25.5 32.54,26.29 R14.2
  Bottom 0.254: IR2.VO 38.05,16.15 40.84,18.92 40.84,20.7 40.56,20.98 v40.56,25.73
TX  (via drill 0.61)
  Top 0.254: SV2.4 51.82,20.14 R15.2 47.78,26.26 v49.66,28.14
  Bottom 0.254: v49.66,28.14 49.66,29.03 Q1.2
TX_IN  (via drill 0.61)
  Top 0.254: v48.23,38.71 48.23,44.75 46.41,46.58 44.27,46.58 v42.14,48.72
  Bottom 0.254: Q1.3 51.59,34.57 R16.2 49.78,35.79 48.64,36.93 48.64,38.3 v48.23,38.71 | v42.14,48.72 37.74,48.72 SV1.1
TXD  (via drill 0.61)
  Top 0.254: UC1.P$43 34.64,40.24 34.82,40.06 34.82,39.5 36.07,38.25 36.07,37.67 v37.21,36.53 | v42.9,26.75 46.43,26.75 v46.46,26.77
  Bottom 0.254: SV2.6 54.36,21.16 48.74,26.77 v46.46,26.77 | v37.21,36.53 39.27,36.53 40.28,35.51 40.28,30.12 38.48,28.32 38.48,27.46 39.19,26.75 40.11,26.75 40.64,27.41 41.83,27.41 42.27,26.75 v42.9,26.75
TXE
  Top 0.254: U$1.7 59.15,41.61 58.42,42.34 58.42,44.4 59.38,45.36 61.57,45.36 63.91,43.03 63.91,20.57 59.64,16.31 SV2.7
  Bottom 0.254: SV2.2 49.28,18.8 50.55,17.53 55.68,17.53 SV2.7
USBDM
  Bottom 0.254: R2.1 42.75,41.5 43.18,41.94 46.99,41.94 47.57,42.52 47.57,43.81 47.22,44.17 47.22,47.93 50.88,51.59 50.88,53.59 47.09,57.38 36.7,57.38 36.5,57.18 34.87,58.8 10.74,58.8 10.34,58.39 10.34,57.33 10.21,57.2 10.21,56.24 10.64,55.8 14.71,55.8 15.02,55.49 J2.D-
USBDP
  Bottom 0.254: J2.D+ 15.67,53.62 16.1,53.19 20.75,53.19 22.17,54.61 22.63,54.61 22.99,54.97 22.99,57.58 23.62,58.22 33.65,58.22 36.04,55.83 45.59,55.83 48.77,52.65 48.77,51.1 47.01,49.35 44.2,49.35 43.82,48.97 43.82,48.08 44.25,47.65 44.25,47.37 44.43,47.19 44.43,45.19 44.22,44.98 43.15,44.98 42.98,44.81 R3.1
WP
  Top 0.254: UC1.P$59 25.78,45.79 25.91,45.92 25.91,50.34 26.87,51.31 28.65,51.31 29.39,52.04 29.39,52.68 28.45,53.62 28.12,53.62 26.92,54.81 IC1.7